# EAGLE design usb_host_eurorack (EAGLE 8.0.0)
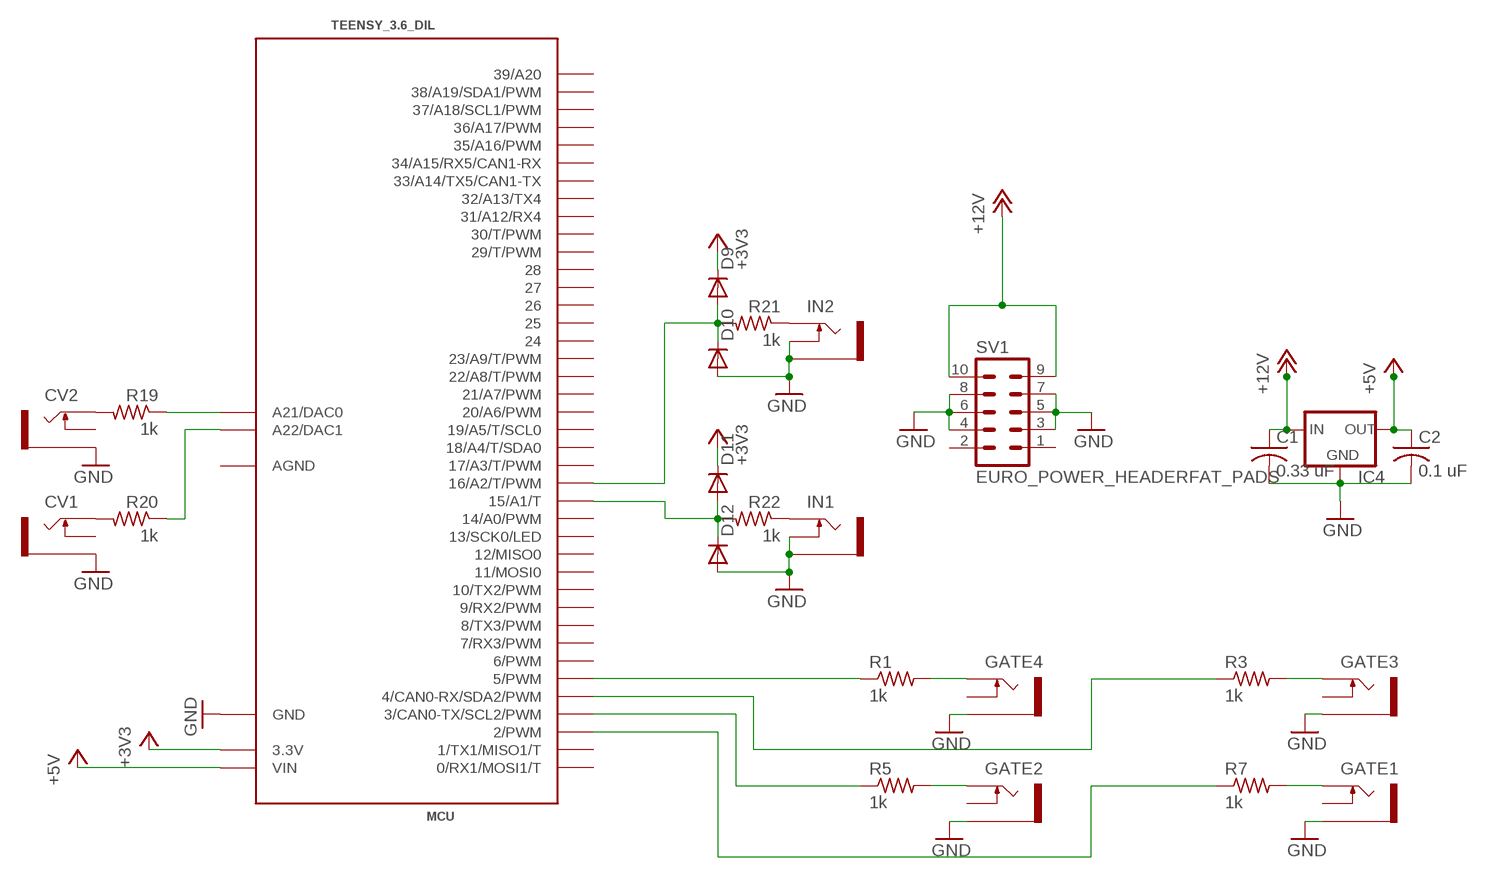
[diagram p0: schematic, sheet 1]

## Parts
C1  0.33 uF  C-US025-030X050  [C025-030X050]
C2  0.1 uF  C-US025-030X050  [C025-030X050]
CV1  PJ302M  [PJ302M]
CV2  PJ302M  [PJ302M]
D9  SMALL_DIODEDO35-7  [DO35-7]
D10  SMALL_DIODEDO35-7  [DO35-7]
D11  SMALL_DIODEDO35-7  [DO35-7]
D12  SMALL_DIODEDO35-7  [DO35-7]
GATE1  PJ302M  [PJ302M]
GATE2  PJ302M  [PJ302M]
GATE3  PJ302M  [PJ302M]
GATE4  PJ302M  [PJ302M]
IC4  78XXL  [78XXL]
IN1  PJ302M  [PJ302M]
IN2  PJ302M  [PJ302M]
MCU  TEENSY_3.6_DIL  [TEENSY_3.6_DIL]
R1  1k  R-US_0207/10  [0207/10]
R3  1k  R-US_0207/10  [0207/10]
R5  1k  R-US_0207/10  [0207/10]
R7  1k  R-US_0207/10  [0207/10]
R19  1k  R-US_0207/10  [0207/10]
R20  1k  R-US_0207/10  [0207/10]
R21  1k  R-US_0207/10  [0207/10]
R22  1k  R-US_0207/10  [0207/10]
SV1  EURO_POWER_HEADERFAT_PADS  [EURO_PWR_HEADER_FAT]

## Nets
+3V3: D9.C D11.C MCU.3.3V MCU.3.3V3(3.3V)
+5V: C2.1 IC4.OUT MCU.VIN
+12V: C1.1 IC4.IN SV1.9 SV1.10
GND: C1.2 C2.2 CV1.GND(SLEEVE) CV2.GND(SLEEVE) D10.A D12.A GATE1.GND(SLEEVE) GATE2.GND(SLEEVE) GATE3.GND(SLEEVE) GATE4.GND(SLEEVE) IC4.GND IN1.GND(SLEEVE) IN1.SW(SWITCH) IN2.GND(SLEEVE) IN2.SW(SWITCH) MCU.GND MCU.GND1(GND) SV1.3 SV1.4 SV1.5 SV1.6 SV1.7 SV1.8
I1: D9.A D10.C MCU.16/A2(16/A2/T/PWM) R21.2
I2: D11.A D12.C MCU.15/A1(15/A1/T) R22.2
N$1: GATE4.TIP R1.2
N$2: MCU.A22(A22/DAC1) R20.1
N$3: MCU.5(5/PWM) R1.1
N$4: GATE3.TIP R3.2
N$5: MCU.A21(A21/DAC0) R19.1
N$6: MCU.4(4/CAN0-RX/SDA2/PWM) R3.1
N$7: GATE2.TIP R5.2
N$9: MCU.3(3/CAN0-TX/SCL2/PWM) R5.1
N$10: GATE1.TIP R7.2
N$12: MCU.2(2/PWM) R7.1
N$25: IN2.TIP R21.1
N$26: IN1.TIP R22.1
N$32: CV2.TIP R19.2
N$33: CV1.TIP R20.2
Unconnected: CV1.SW(SWITCH) CV2.SW(SWITCH) GATE1.SW(SWITCH) GATE2.SW(SWITCH) GATE3.SW(SWITCH) GATE4.SW(SWITCH) MCU.0(0/RX1/MOSI1/T) MCU.1(1/TX1/MISO1/T) MCU.6(6/PWM) MCU.7(7/RX3/PWM) MCU.8(8/TX3/PWM) MCU.9(9/RX2/PWM) MCU.10(10/TX2/PWM) MCU.11(11/MOSI0) MCU.12(12/MISO0) MCU.13(13/SCK0/LED) MCU.14/A0(14/A0/PWM) MCU.17/A3(17/A3/T/PWM) MCU.18/A4(18/A4/T/SDA0) MCU.19/A5(19/A5/T/SCL0) MCU.20/A6(20/A6/PWM) MCU.21/A7(21/A7/PWM) MCU.22/A8(22/A8/T/PWM) MCU.23/A9(23/A9/T/PWM) MCU.24 MCU.25 MCU.26 MCU.27 MCU.28 MCU.29(29/T/PWM) MCU.30(30/T/PWM) MCU.31/A12(31/A12/RX4) MCU.32/A13(32/A13/TX4) MCU.33/A14(33/A14/TX5/CAN1-TX) MCU.34/A15(34/A15/RX5/CAN1-RX) MCU.35/A16(35/A16/PWM) MCU.36/A17(36/A17/PWM) MCU.37/A18(37/A18/SCL1/PWM) MCU.38/A19(38/A19/SDA1/PWM) MCU.39/A20 SV1.1 SV1.2

## Power pins joined to a net without a drawn wire
AGND: MCU.AGND

## Library data of the parts
C1 C2 = rcl:C-US: CAPACITOR, American symbol
CV1 CV2 GATE1-GATE4 IN1 IN2 = pj302m:PJ302M: PJ302M horizontal / right angled mount 3.5 mm jack socket
D9-D12 = MusicThingModular:SMALL_DIODE: Small Signal Diode
IC4 = v-reg:78XXL: VOLTAGE REGULATOR
MCU = Teensy_3_and_LC_Series_Boards_v1.4:TEENSY_3.6_DIL: Teensy 3.6 DIL Package
R1 R3 R5 R7 R19-R22 = rcl:R-US_: RESISTOR, American symbol
SV1 = MusicThingModular:EURO_POWER_HEADER: Power Header 10 pin power header for Eurorack Power Supplies Variants with fatter pads for easier soldering, and the LOCK variant which has 5mil offset pins to hold the component in place before soldering

## Board
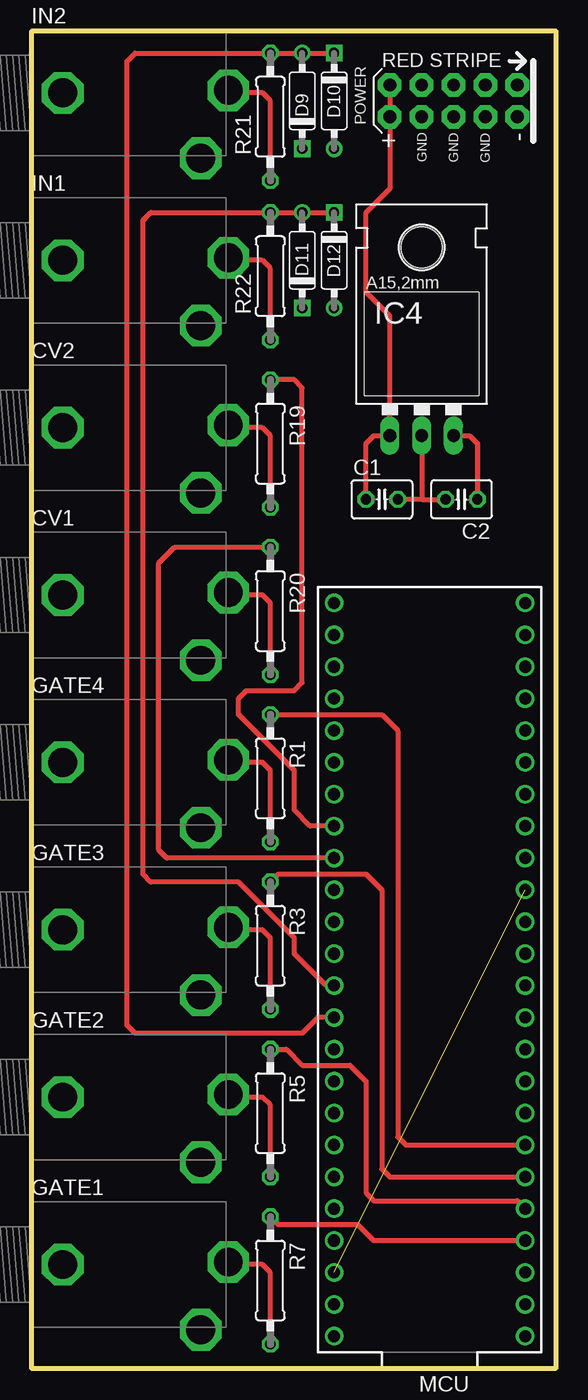
[diagram p1: board, top side]
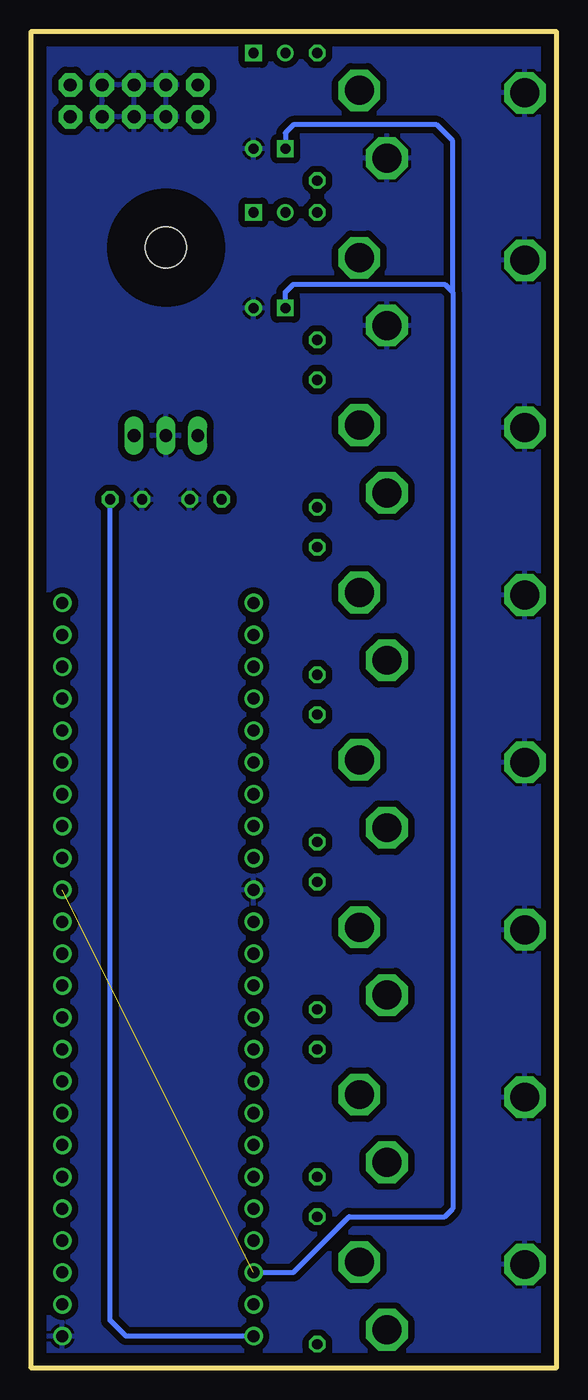
[diagram p2: board, bottom side, seen from below]

Size 41.84 x 106.5 mm. Coordinates in mm from the lower left corner, seen from the top.
Outline: 0,0 41.84,0 41.84,106.5 0,106.5 0,0
Copper layers (1*16): Top 0.035mm / dielectric 1.5mm / Bottom 0.035mm
Design rules "default": minimum track width 10mil, minimum drill 24mil, track to track 8mil, track to pad 8mil, pad to pad 8mil, via to via 8mil, smd to smd 8mil, copper to edge 40mil, drill to drill 8mil, minimum pad ring 10mil, minimum via ring 8mil, stop-mask expansion 4mil, vias tented up to drill 0mil, thermal gap 10mil

### Footprints (pad centres in the part's own frame; a part is rotated, then mirrored left to right if it is on the bottom)
C025-030X050 = drill 0.813 octagon: 1 -1.27,0; 2 1.27,0
PJ302M = drill 2.3 pad 3.3 octagon: GND 2.5,0; SW 13.5,-5.2; TIP 15.7,0.2
DO35-7 = drill 0.813: A 3.81,0 | drill 0.813 square: C -3.81,0
78XXL = drill 1.016 long: GND 0,-3.81; IN -2.54,-3.81; OUT 2.54,-3.81 | hole 3.302: 0,11.176
TEENSY_3.6_DIL = drill 0.965: 0 -7.62,25.4; 1 -7.62,22.86; 2 -7.62,20.32; 3 -7.62,17.78; 3.3V 7.62,22.86; 3.3V3 -7.62,-7.62; 4 -7.62,15.24; 5 -7.62,12.7; 6 -7.62,10.16; 7 -7.62,7.62; 8 -7.62,5.08; 9 -7.62,2.54; 10 -7.62,0; 11 -7.62,-2.54; 12 -7.62,-5.08; 13 7.62,-5.08; 14/A0 7.62,-2.54; 15/A1 7.62,0; 16/A2 7.62,2.54; 17/A3 7.62,5.08; 18/A4 7.62,7.62; 19/A5 7.62,10.16; 20/A6 7.62,12.7; 21/A7 7.62,15.24; 22/A8 7.62,17.78; 23/A9 7.62,20.32; 24 -7.62,-10.16; 25 -7.62,-12.7; 26 -7.62,-15.24; 27 -7.62,-17.78; 28 -7.62,-20.32; 29 -7.62,-22.86; 30 -7.62,-25.4; 31/A12 -7.62,-27.94; 32/A13 -7.62,-30.48; 33/A14 7.62,-30.48; 34/A15 7.62,-27.94; 35/A16 7.62,-25.4; 36/A17 7.62,-22.86; 37/A18 7.62,-20.32; 38/A19 7.62,-17.78; 39/A20 7.62,-15.24; A21 7.62,-12.7; A22 7.62,-10.16; AGND 7.62,25.4; GND -7.62,27.94; GND1 7.62,-7.62; VIN 7.62,27.94
0207/10 = drill 0.813 octagon: 1 -5.08,0; 2 5.08,0
EURO_PWR_HEADER_FAT = drill 1.016 pad 1.88 octagon: 1 -5.08,-1.27; 2 -5.08,1.27; 3 -2.54,-1.27; 4 -2.54,1.27; 5 0,-1.27; 6 0,1.27; 7 2.54,-1.27; 8 2.54,1.27; 9 5.08,-1.27; 10 5.08,1.27

### Placement (x,y rotation side)
C1  27.94,69.22 0 top
C2  34.29,69.22 180 top
CV1  0,61.59 0 top
CV2  0,74.93 0 top
D9  21.59,100.97 90 top
D10  24.13,100.97 270 top
D11  21.59,88.27 90 top
D12  24.13,88.27 270 top
GATE1  0,8.26 0 top
GATE2  0,21.59 0 top
GATE3  0,34.92 0 top
GATE4  0,48.26 0 top
IC4  31.11,78.11 0 top
IN1  0,88.27 0 top
IN2  0,101.6 0 top
MCU  31.75,30.48 180 top
R1  19.05,46.99 270 top
R3  19.05,33.66 270 top
R5  19.05,20.32 270 top
R7  19.05,6.99 270 top
R19  19.05,73.66 270 top
R20  19.05,60.33 270 top
R21  19.05,99.69 90 top
R22  19.05,87 90 top
SV1  33.66,100.97 180 top

### Tracks (layer width: path | path; a pad name or v marks a point on that pad's centre or on a via)
+3V3  (1 unrouted)
  Bottom 0.406: MCU.3.3V 20.95,7.62 16.51,12.06 8.89,12.06 8.26,12.7 8.26,85.72 | 8.26,85.72 8.26,97.79 9.53,99.06 20.95,99.06 21.59,98.42 D9.C | D11.C 21.59,85.72 20.95,86.36 8.89,86.36 8.26,85.72
+5V
  Top 0.406: IC4.OUT 34.92,74.3 35.56,73.66 C2.1
  Bottom 0.406: MCU.VIN 34.29,2.54 35.56,3.81 C2.1
+12V
  Top 0.406: SV1.9 SV1.10 28.57,93.98 26.67,92.08 26.67,85.72 28.57,83.82 IC4.IN 27.3,74.3 26.67,73.66 C1.1
GND
  Top 0.406: 31.11,69.22 C1.2 | 31.11,69.22 C2.2 | IC4.GND 31.11,69.22
  pour Bottom (isolate 0.508): 0.64,0 41.91,0 41.91,106.68 0,106.68 0,0
I1
  Top 0.406: D10.C D9.A R21.2 8.26,104.78 7.62,104.14 7.62,27.3 8.26,26.67 21.59,26.67 22.86,27.94 MCU.16/A2
I2
  Top 0.406: D12.C D11.A R22.2 9.53,92.08 8.89,91.44 8.89,39.37 9.53,38.73 16.51,38.73 20.95,34.29 20.95,33.02 23.5,30.48 MCU.15/A1
N$1
  Top 0.406: R1.2 19.05,47.62 18.41,48.26 15.9,48.26 GATE4.TIP
N$2
  Top 0.406: MCU.A22 10.79,40.64 10.16,41.27 10.16,64.14 11.43,65.41 R20.1
N$3
  Top 0.406: R1.1 27.94,52.07 29.21,50.8 29.21,18.41 29.84,17.78 MCU.5
N$4
  Top 0.406: R3.2 19.05,34.29 18.41,34.92 15.9,34.92 GATE3.TIP
N$5
  Top 0.406: MCU.A21 22.23,43.18 20.95,44.45 20.95,47.62 16.51,52.07 16.51,53.34 17.14,53.98 20.95,53.98 21.59,54.61 21.59,78.11 20.95,78.74 R19.1
N$6
  Top 0.406: R3.1 19.68,39.37 26.67,39.37 27.94,38.1 27.94,15.88 28.57,15.24 MCU.4
N$7
  Top 0.406: R5.2 19.05,20.95 18.41,21.59 15.9,21.59 GATE2.TIP
N$9
  Top 0.406: R5.1 20.32,25.4 21.59,24.13 25.4,24.13 26.67,22.86 26.67,13.97 27.3,13.34 38.73,13.34 MCU.3
N$10
  Top 0.406: R7.2 19.05,7.62 18.41,8.26 15.9,8.26 GATE1.TIP
N$12
  Top 0.406: MCU.2 27.3,10.16 26.04,11.43 19.68,11.43 R7.1
N$25
  Top 0.406: R21.1 19.05,100.97 18.41,101.6 15.9,101.6 IN2.TIP
N$26
  Top 0.406: R22.1 19.05,87.63 18.41,88.27 15.9,88.27 IN1.TIP
N$32
  Top 0.406: R19.2 19.05,74.3 18.41,74.93 15.9,74.93 CV2.TIP
N$33
  Top 0.406: R20.2 19.05,60.96 18.41,61.59 15.9,61.59 CV1.TIP